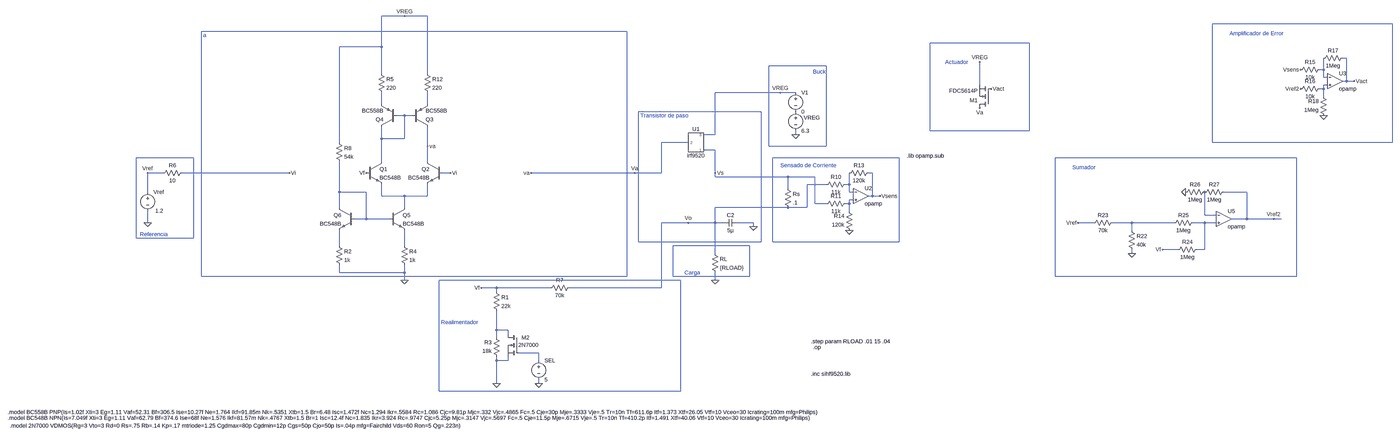
[diagram p0: schematic LDO.asc, whole sheet]
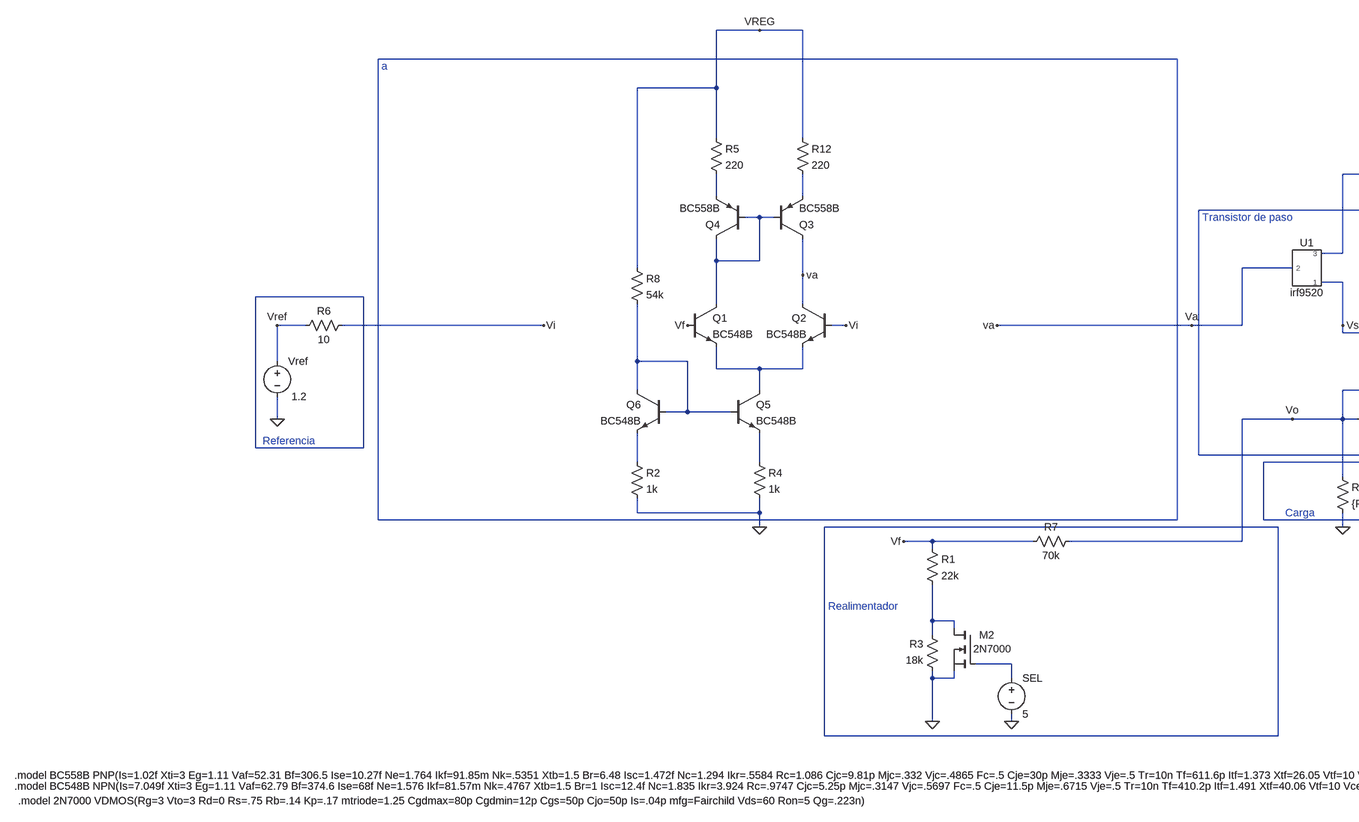
[diagram p1: schematic LDO.asc, part, row 1 of 1, column 1 of 2]
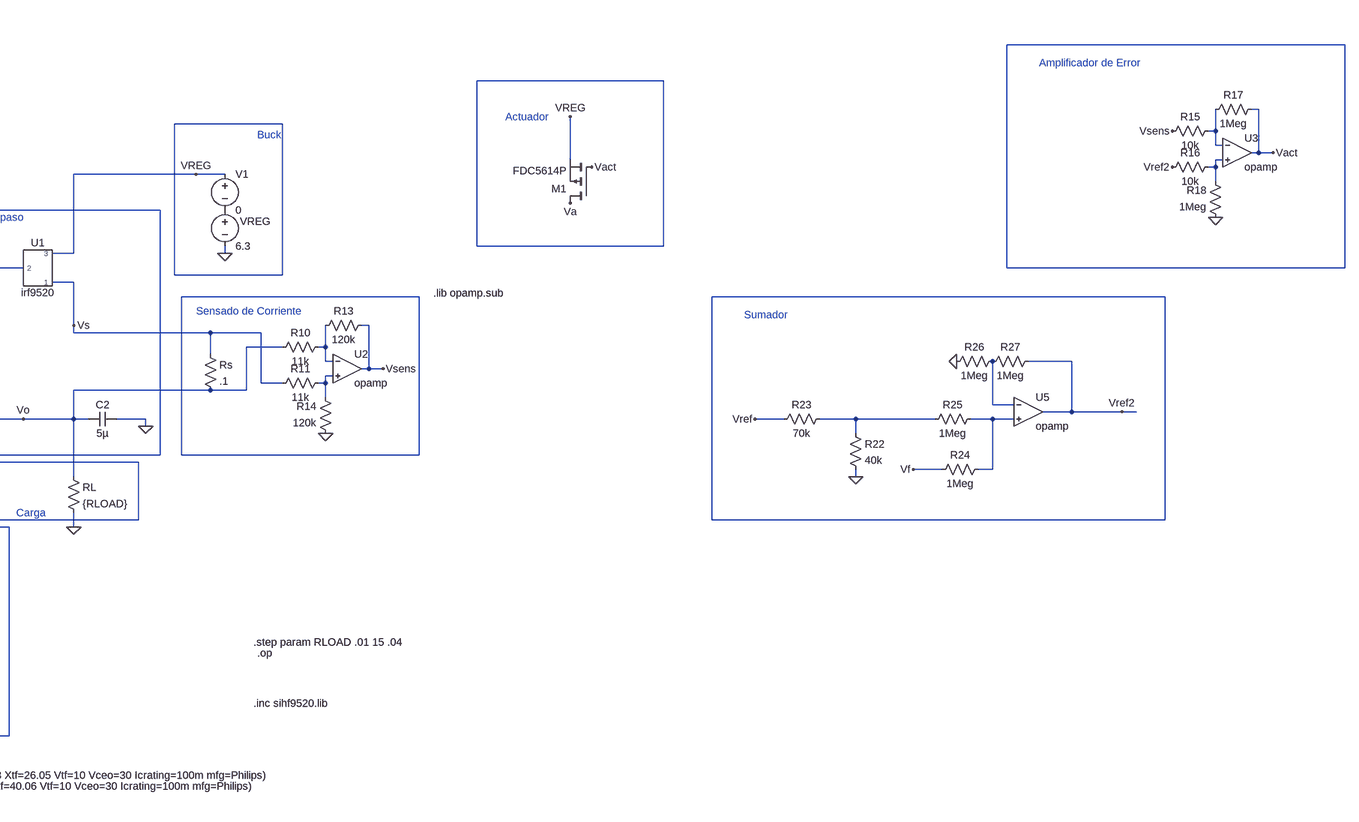
[diagram p2: schematic LDO.asc, part, row 1 of 1, column 2 of 2]
LDO.asc, the LTspice schematic file:
Version 4
SHEET 1 26844 1184
WIRE 336 -544 240 -544
WIRE 432 -544 336 -544
WIRE 4848 -512 3840 -512
WIRE 1264 -480 -512 -480
WIRE 2992 -432 2528 -432
WIRE 240 -416 240 -544
WIRE 240 -416 64 -416
WIRE 4400 -368 4384 -368
WIRE 2096 -336 1856 -336
WIRE 4304 -320 4304 -368
WIRE 4304 -320 4288 -320
WIRE 240 -304 240 -416
WIRE 432 -304 432 -544
WIRE 4304 -288 4304 -320
WIRE 4320 -288 4304 -288
WIRE 4400 -272 4400 -368
WIRE 4400 -272 4384 -272
WIRE 4432 -272 4400 -272
WIRE 2736 -256 2736 -352
WIRE 4320 -256 4304 -256
WIRE 4304 -240 4304 -256
WIRE 4304 -240 4288 -240
WIRE 1904 -224 1632 -224
WIRE 1968 -224 1904 -224
WIRE 4304 -208 4304 -240
WIRE 240 -176 240 -224
WIRE 432 -176 432 -224
WIRE 1824 -144 1312 -144
WIRE 336 -128 304 -128
WIRE 368 -128 336 -128
WIRE 2528 -64 2528 -432
WIRE 2992 -64 2992 -432
WIRE 2992 -64 2528 -64
WIRE 1632 -48 1632 -224
WIRE 1632 -48 1584 -48
WIRE 1968 -48 1968 -64
WIRE 240 -32 240 -80
WIRE 336 -32 336 -128
WIRE 336 -32 240 -32
WIRE 64 -16 64 -416
WIRE 1520 -16 1408 -16
WIRE 3840 -16 3840 -512
WIRE 4848 -16 4848 -512
WIRE 4848 -16 3840 -16
WIRE 432 0 432 -80
WIRE 1856 0 1856 -336
WIRE 2096 0 2096 -336
WIRE 2096 0 1856 0
WIRE 1632 16 1584 16
WIRE -544 48 -784 48
WIRE 2400 48 1872 48
WIRE 4192 48 3184 48
WIRE 240 64 240 -32
WIRE 432 64 432 0
WIRE -672 112 -736 112
WIRE -144 112 -592 112
WIRE 528 112 496 112
WIRE 1296 112 864 112
WIRE 1408 112 1408 -16
WIRE 1408 112 1296 112
WIRE 1632 112 1632 16
WIRE 2288 112 2272 112
WIRE 1632 128 1632 112
WIRE 1936 128 1632 128
WIRE 2048 128 1936 128
WIRE 2096 160 2016 160
WIRE 2192 160 2192 112
WIRE 2192 160 2176 160
WIRE 1936 176 1936 128
WIRE -736 192 -736 112
WIRE 64 192 64 64
WIRE 176 192 64 192
WIRE 2192 192 2192 160
WIRE 2208 192 2192 192
WIRE 3984 192 3888 192
WIRE 240 208 240 160
WIRE 336 208 240 208
WIRE 432 208 432 160
WIRE 432 208 336 208
WIRE 2288 208 2288 112
WIRE 2288 208 2272 208
WIRE 2320 208 2288 208
WIRE 2208 224 2192 224
WIRE 2048 240 2048 128
WIRE 2096 240 2048 240
WIRE 2192 240 2192 224
WIRE 2192 240 2176 240
WIRE 64 256 64 192
WIRE 336 256 336 208
WIRE 1936 256 1632 256
WIRE 2016 256 2016 160
WIRE 2016 256 1936 256
WIRE 2192 272 2192 240
WIRE 3808 288 3808 192
WIRE 3856 288 3808 288
WIRE 176 304 176 192
WIRE 176 304 128 304
WIRE 272 304 176 304
WIRE 3984 304 3984 192
WIRE 3984 304 3920 304
WIRE 4096 304 3984 304
WIRE 4128 304 4096 304
WIRE -736 320 -736 272
WIRE 1520 320 1408 320
WIRE 1632 320 1632 256
WIRE 1632 320 1520 320
WIRE 1664 320 1632 320
WIRE 1792 320 1728 320
WIRE 3344 320 3280 320
WIRE 3504 320 3424 320
WIRE 3680 320 3504 320
WIRE 3808 320 3760 320
WIRE 3856 320 3808 320
WIRE 1792 336 1792 320
WIRE 3504 352 3504 320
WIRE -784 384 -784 48
WIRE -544 384 -544 48
WIRE -544 384 -784 384
WIRE 1312 400 1312 -144
WIRE 1824 400 1824 -144
WIRE 1824 400 1312 400
WIRE 1872 400 1872 48
WIRE 2400 400 2400 48
WIRE 2400 400 1872 400
WIRE 64 416 64 352
WIRE 336 416 336 352
WIRE 1776 416 1456 416
WIRE 3696 432 3632 432
WIRE 3808 432 3808 320
WIRE 3808 432 3776 432
WIRE 1632 448 1632 320
WIRE 3504 448 3504 432
WIRE 64 528 64 496
WIRE 336 528 336 496
WIRE 336 528 64 528
WIRE -512 544 -512 -480
WIRE 1264 544 1264 -480
WIRE 1264 544 -512 544
WIRE 1456 544 1456 416
WIRE 1776 544 1776 416
WIRE 1776 544 1456 544
WIRE 3184 544 3184 48
WIRE 4192 544 4192 48
WIRE 4192 544 3184 544
WIRE 336 560 336 528
WIRE 1488 560 480 560
WIRE 1632 560 1632 528
WIRE 720 592 656 592
WIRE 944 592 720 592
WIRE 1408 592 1408 320
WIRE 1408 592 1024 592
WIRE 720 608 720 592
WIRE 720 768 720 688
WIRE 768 768 720 768
WIRE 768 784 768 768
WIRE 720 800 720 768
WIRE 896 864 816 864
WIRE 720 896 720 880
WIRE 768 896 768 880
WIRE 768 896 720 896
WIRE 896 896 896 864
WIRE 720 992 720 896
WIRE 896 992 896 976
WIRE 480 1024 480 560
WIRE 1488 1024 1488 560
WIRE 1488 1024 480 1024
FLAG 1632 560 0
FLAG -736 320 0
FLAG 1296 112 Va
FLAG -736 112 Vref
FLAG 720 992 0
FLAG 1520 320 Vo
FLAG 1968 -48 0
FLAG 1792 336 0
FLAG 336 560 0
FLAG 656 592 Vf
FLAG 336 -544 VREG
FLAG -144 112 Vi
FLAG 432 0 va
FLAG 864 112 va
FLAG 528 112 Vi
FLAG 176 112 Vf
FLAG 1904 -224 VREG
FLAG 896 992 0
FLAG 1632 112 Vs
FLAG 2736 -352 VREG
FLAG 2784 -240 Vact
FLAG 2736 -160 Va
FLAG 2320 208 Vsens
FLAG 2192 352 0
FLAG 3504 448 0
FLAG 4096 304 Vref2
FLAG 3280 320 Vref
FLAG 3632 432 Vf
FLAG 3728 192 0
FLAG 4304 -128 0
FLAG 4432 -272 Vact
FLAG 4208 -240 Vref2
FLAG 4208 -320 Vsens
SYMBOL voltage -736 176 R0
WINDOW 123 0 0 Left 0
WINDOW 39 0 0 Left 0
WINDOW 3 66 94 Right 2
SYMATTR Value 1.2
SYMATTR InstName Vref
SYMBOL res 1616 432 R0
SYMATTR InstName RL
SYMATTR Value {RLOAD}
SYMBOL res 704 592 R0
SYMATTR InstName R1
SYMATTR Value 22k
SYMBOL res 736 896 R180
WINDOW 0 36 76 Left 2
WINDOW 3 36 40 Left 2
SYMATTR InstName R3
SYMATTR Value 18k
SYMBOL voltage 1968 -160 R0
WINDOW 123 0 0 Left 0
WINDOW 39 0 0 Left 0
WINDOW 0 34 41 Left 2
SYMATTR InstName VREG
SYMATTR Value 6.3
SYMBOL voltage 1968 -240 R0
WINDOW 123 0 0 Left 0
WINDOW 39 0 0 Left 0
SYMATTR InstName V1
SYMATTR Value 0
SYMBOL cap 1728 304 R90
WINDOW 0 0 32 VBottom 2
WINDOW 3 32 32 VTop 2
SYMATTR InstName C2
SYMATTR Value 5µ
SYMBOL npn 176 64 R0
SYMATTR InstName Q1
SYMATTR Value BC548B
SYMBOL npn 496 64 M0
SYMATTR InstName Q2
SYMATTR Value BC548B
SYMBOL pnp 368 -80 M180
SYMATTR InstName Q3
SYMATTR Value BC558B
SYMBOL pnp 304 -80 R180
SYMATTR InstName Q4
SYMATTR Value BC558B
SYMBOL res 224 -320 R0
SYMATTR InstName R5
SYMATTR Value 220
SYMBOL res -576 96 R90
WINDOW 0 0 56 VBottom 2
WINDOW 3 32 56 VTop 2
SYMATTR InstName R6
SYMATTR Value 10
SYMBOL res 1040 576 R90
WINDOW 0 0 56 VBottom 2
WINDOW 3 32 56 VTop 2
SYMATTR InstName R7
SYMATTR Value 70k
SYMBOL voltage 896 880 R0
WINDOW 123 0 0 Left 0
WINDOW 39 0 0 Left 0
SYMATTR InstName SEL
SYMATTR Value 5
SYMBOL npn 272 256 R0
SYMATTR InstName Q5
SYMATTR Value BC548B
SYMBOL npn 128 256 M0
SYMATTR InstName Q6
SYMATTR Value BC548B
SYMBOL res 48 -32 R0
SYMATTR InstName R8
SYMATTR Value 54k
SYMBOL res 48 400 R0
SYMATTR InstName R2
SYMATTR Value 1k
SYMBOL res 320 400 R0
SYMATTR InstName R4
SYMATTR Value 1k
SYMBOL res 1920 160 R0
SYMATTR InstName Rs
SYMATTR Value .1
SYMBOL res 416 -320 R0
SYMATTR InstName R12
SYMATTR Value 220
SYMBOL nmos 816 784 M0
WINDOW 0 -42 16 Left 2
WINDOW 3 -80 47 Left 2
SYMATTR InstName M2
SYMATTR Value 2N7000
SYMBOL AutoGenerated\\irf9520 1552 -16 R0
SYMATTR InstName U1
SYMBOL pmos 2784 -160 R180
SYMATTR InstName M1
SYMATTR Value FDC5614P
SYMBOL OpAmps\\opamp 2240 144 R0
SYMATTR InstName U2
SYMBOL res 2192 144 R90
WINDOW 0 0 56 VBottom 2
WINDOW 3 32 56 VTop 2
SYMATTR InstName R10
SYMATTR Value 11k
SYMBOL res 2192 224 R90
WINDOW 0 0 56 VBottom 2
WINDOW 3 32 56 VTop 2
SYMATTR InstName R11
SYMATTR Value 11k
SYMBOL res 2288 96 R90
WINDOW 0 0 56 VBottom 2
WINDOW 3 32 56 VTop 2
SYMATTR InstName R13
SYMATTR Value 120k
SYMBOL res 2208 368 R180
WINDOW 0 36 76 Left 2
WINDOW 3 36 40 Left 2
SYMATTR InstName R14
SYMATTR Value 120k
SYMBOL res 3488 336 R0
SYMATTR InstName R22
SYMATTR Value 40k
SYMBOL res 3440 304 R90
WINDOW 0 0 56 VBottom 2
WINDOW 3 32 56 VTop 2
SYMATTR InstName R23
SYMATTR Value 70k
SYMBOL res 3792 416 R90
WINDOW 0 0 56 VBottom 2
WINDOW 3 32 56 VTop 2
SYMATTR InstName R24
SYMATTR Value 1Meg
SYMBOL res 3776 304 R90
WINDOW 0 0 56 VBottom 2
WINDOW 3 32 56 VTop 2
SYMATTR InstName R25
SYMATTR Value 1Meg
SYMBOL OpAmps\\opamp 3888 240 R0
SYMATTR InstName U5
SYMBOL res 3824 176 R90
WINDOW 0 0 56 VBottom 2
WINDOW 3 32 56 VTop 2
SYMATTR InstName R26
SYMATTR Value 1Meg
SYMBOL res 3904 176 R90
WINDOW 0 0 56 VBottom 2
WINDOW 3 32 56 VTop 2
SYMATTR InstName R27
SYMATTR Value 1Meg
SYMBOL OpAmps\\opamp 4352 -336 R0
SYMATTR InstName U3
SYMBOL res 4304 -336 R90
WINDOW 0 0 56 VBottom 2
WINDOW 3 32 56 VTop 2
SYMATTR InstName R15
SYMATTR Value 10k
SYMBOL res 4304 -256 R90
WINDOW 0 0 56 VBottom 2
WINDOW 3 32 56 VTop 2
SYMATTR InstName R16
SYMATTR Value 10k
SYMBOL res 4400 -384 R90
WINDOW 0 0 56 VBottom 2
WINDOW 3 32 56 VTop 2
SYMATTR InstName R17
SYMATTR Value 1Meg
SYMBOL res 4320 -112 R180
WINDOW 0 36 76 Left 2
WINDOW 3 36 40 Left 2
SYMATTR InstName R18
SYMATTR Value 1Meg
TEXT -768 368 Left 2 ;Referencia
TEXT 488 736 Left 2 ;Realimentador
TEXT -504 -464 Left 2 ;a
TEXT 1320 -128 Left 2 ;Transistor de paso
TEXT 1504 528 Left 2 ;Carga
TEXT 2032 816 Left 2 !.step param RLOAD .01 15 .04
TEXT -1320 1112 Left 2 !.model BC558B PNP(Is=1.02f Xti=3 Eg=1.11 Vaf=52.31 Bf=306.5 Ise=10.27f Ne=1.764 Ikf=91.85m Nk=.5351 Xtb=1.5 Br=6.48 Isc=1.472f Nc=1.294 Ikr=.5584 Rc=1.086 Cjc=9.81p Mjc=.332 Vjc=.4865 Fc=.5 Cje=30p Mje=.3333 Vje=.5 Tr=10n Tf=611.6p Itf=1.373 Xtf=26.05 Vtf=10 Vceo=30 Icrating=100m mfg=Philips)
TEXT -1320 1136 Left 2 !.model BC548B NPN(Is=7.049f Xti=3 Eg=1.11 Vaf=62.79 Bf=374.6 Ise=68f Ne=1.576 Ikf=81.57m Nk=.4767 Xtb=1.5 Br=1 Isc=12.4f Nc=1.835 Ikr=3.924 Rc=.9747 Cjc=5.25p Mjc=.3147 Vjc=.5697 Fc=.5 Cje=11.5p Mje=.6715 Vje=.5 Tr=10n Tf=410.2p Itf=1.491 Xtf=40.06 Vtf=10 Vceo=30 Icrating=100m mfg=Philips)
TEXT 2040 840 Left 2 !.op
TEXT 2040 -312 Left 2 ;Buck
TEXT 2032 952 Left 2 !.inc sihf9520.lib
TEXT -1312 1168 Left 2 !.model 2N7000 VDMOS(Rg=3 Vto=3 Rd=0 Rs=.75 Rb=.14 Kp=.17 mtriode=1.25 Cgdmax=80p Cgdmin=12p Cgs=50p Cjo=50p Is=.04p mfg=Fairchild Vds=60 Ron=5 Qg=.223n)
TEXT 2592 -352 Left 2 ;Actuador
TEXT 2432 40 Left 2 !.lib opamp.sub
TEXT 3256 88 Left 2 ;Sumador
TEXT 3912 -472 Left 2 ;Amplificador de Error
TEXT 1904 80 Left 2 ;Sensado de Corriente

The netlist it stands for:
* LDO.asc
Vref Vref 0 1.2
RL Vo 0 {RLOAD}
R1 Vf N025 22k
R3 0 N025 18k
VREG P001 0 6.3
V1 VREG P001 0
C2 0 Vo 5µ
Q1 N010 Vf N016 0 BC548B
Q2 Va Vi N016 0 BC548B
Q3 Va N010 N008 0 BC558B
Q4 N010 N010 N007 0 BC558B
R5 VREG N007 220
R6 Vi Vref 10
R7 Vo Vf 70k
V§SEL N026 0 5
Q5 N016 N015 N022 0 BC548B
Q6 N015 N015 N021 0 BC548B
R8 VREG N015 54k
R2 N021 0 1k
R4 N022 0 1k
Rs Vs Vo .1
R12 VREG N008 220
M2 N025 N026 0 0 2N7000
XU1 Vs Va VREG irf9520  ; pins 1 2 3
M1 Va Vact VREG VREG FDC5614P
XU2 N014 N017 Vsens opamp Aol=100K GBW=10Meg  ; pins invin noninvin out
R10 N014 Vo 11k
R11 N017 Vs 11k
R13 Vsens N014 120k
R14 0 N017 120k
R22 N019 0 40k
R23 N019 Vref 70k
R24 N020 Vf 1Meg
R25 N020 N019 1Meg
XU5 N018 N020 Vref2 opamp Aol=100K GBW=10Meg  ; pins invin noninvin out
R26 N018 0 1Meg
R27 Vref2 N018 1Meg
XU3 N005 N006 Vact opamp Aol=100K GBW=10Meg  ; pins invin noninvin out
R15 N005 Vsens 10k
R16 N006 Vref2 10k
R17 Vact N005 1Meg
R18 0 N006 1Meg
.model NPN NPN
.model PNP PNP
.lib standard.bjt
.model NMOS NMOS
.model PMOS PMOS
.lib standard.mos
* Referencia
* Realimentador
* a
* Transistor de paso
* Carga
.step param RLOAD .01 15 .04
.model BC558B PNP(Is=1.02f Xti=3 Eg=1.11 Vaf=52.31 Bf=306.5 Ise=10.27f Ne=1.764 Ikf=91.85m Nk=.5351 Xtb=1.5 Br=6.48 Isc=1.472f Nc=1.294 Ikr=.5584 Rc=1.086 Cjc=9.81p Mjc=.332 Vjc=.4865 Fc=.5 Cje=30p Mje=.3333 Vje=.5 Tr=10n Tf=611.6p Itf=1.373 Xtf=26.05 Vtf=10 Vceo=30 Icrating=100m mfg=Philips)
.model BC548B NPN(Is=7.049f Xti=3 Eg=1.11 Vaf=62.79 Bf=374.6 Ise=68f Ne=1.576 Ikf=81.57m Nk=.4767 Xtb=1.5 Br=1 Isc=12.4f Nc=1.835 Ikr=3.924 Rc=.9747 Cjc=5.25p Mjc=.3147 Vjc=.5697 Fc=.5 Cje=11.5p Mje=.6715 Vje=.5 Tr=10n Tf=410.2p Itf=1.491 Xtf=40.06 Vtf=10 Vceo=30 Icrating=100m mfg=Philips)
.op
* Buck
.inc sihf9520.lib
.model 2N7000 VDMOS(Rg=3 Vto=3 Rd=0 Rs=.75 Rb=.14 Kp=.17 mtriode=1.25 Cgdmax=80p Cgdmin=12p Cgs=50p Cjo=50p Is=.04p mfg=Fairchild Vds=60 Ron=5 Qg=.223n)
* Actuador
.lib opamp.sub
* Sumador
* Amplificador de Error
* Sensado de Corriente
.lib sihf9520.txt
.backanno
.end

* Results of the author's LTspice run, read from the files saved beside the schematic
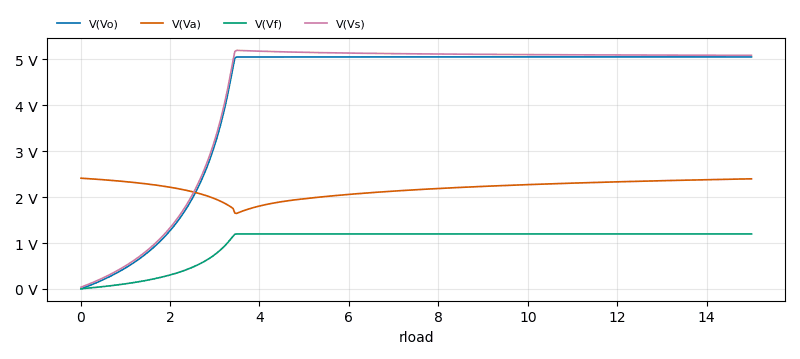
[diagram p3: Operating Point of LDO.asc, plotted from the saved traces]
* Operating Point, 1 run:
*   V(Vo): 3.555 mV at rload=10 m, 5.052 V at rload=15 , min 3.555 mV, max 5.052 V
*   V(Va): 2.411 V at rload=10 m, 2.398 V at rload=15 , min 1.645 V, max 2.411 V
*   V(Vf): 4.421 mV at rload=10 m, 1.198 V at rload=15 , min 4.421 mV, max 1.198 V
*   V(Vs): 39.11 mV at rload=10 m, 5.085 V at rload=15 , min 39.11 mV, max 5.194 V
* From the log:
*   Semiconductor Device Operating Points:
*                           --- Diodes ---
*   Name:    d:u1:4      d:u1:3      d:u1:2      d:u1:1
*   Model:   u1:md3      u1:md2      u1:md1       u1:md
*   Id:     -1.02e-10   -1.48e-10   -2.30e-12   -6.26e-12
*   Vd:     -2.30e+00   -2.30e+00   -2.30e+00   -6.26e+00
*   Req:     1.00e+12    1.00e+12    1.00e+12    1.00e+12
*   CAP:     0.00e+00    0.00e+00    1.79e-10    2.30e-10
*                           --- Bipolar Transistors ---
*   Name:       q4          q3          q6          q5          q2
*   Model:    bc558b      bc558b      bc548b      bc548b      bc548b
*   Ib:      -1.72e-12    1.95e-12    4.65e-07    4.66e-07    4.56e-07
*   Ic:      -6.35e-12   -1.05e-11    1.03e-04    1.03e-04    1.02e-04
*   Vbe:     -2.27e-01   -2.27e-01    6.05e-01    6.05e-01    6.05e-01
*   Vbc:      0.00e+00    3.66e+00    0.00e+00    1.13e-01   -1.21e+00
*   Vce:     -2.27e-01   -3.89e+00    6.05e-01    4.92e-01    1.82e+00
*   BetaDC:   3.70e+00   -5.37e+00    2.20e+02    2.20e+02    2.24e+02
*   Gm:       2.52e-10    2.70e-10    3.96e-03    3.96e-03    3.94e-03
*   Rpi:      2.92e+10    2.92e+10    6.54e+04    6.53e+04    6.68e+04
*   Rx:       0.00e+00    0.00e+00    0.00e+00    0.00e+00    0.00e+00
*   Ro:       6.09e+12    8.01e+12    6.12e+05    6.11e+05    6.27e+05
*   Cbe:      3.67e-11    3.67e-11    3.74e-11    3.74e-11    3.74e-11
*   Cbc:      9.81e-12    4.82e-12    5.25e-12    5.63e-12    3.67e-12
*   Cjs:      0.00e+00    0.00e+00    0.00e+00    0.00e+00    0.00e+00
*   BetaAC:   7.38e+00    7.90e+00    2.59e+02    2.59e+02    2.63e+02
*   Cbx:      0.00e+00    0.00e+00    0.00e+00    0.00e+00    0.00e+00
*   Ft:       8.56e-01    1.03e+00    1.48e+07    1.46e+07    1.53e+07
*   Name:       q1
*   Model:    bc548b
*   Ib:      -6.75e-12
*   Ic:       6.09e-12
*   Vbe:     -5.91e-01
*   Vbc:     -6.07e+00
*   Vce:      5.48e+00
*   BetaDC:  -9.02e-01
*   Gm:       3.58e-23
*   Rpi:      1.00e+12
*   Rx:       0.00e+00
*   Ro:       7.43e+25
*   Cbe:      6.81e-12
*   Cbc:      2.42e-12
*   Cjs:      0.00e+00
*   BetaAC:   3.58e-11
*   Cbx:      0.00e+00
*   Ft:       1.72e-02
*                           --- VDMOSFET Transistors ---
*   Name:          m1          m2
*   Model:      fdc5614p     2n7000
*   Id:         -1.02e-04    2.01e-07
*   Vgs:        -1.55e+00    5.00e+00
*   Vds:        -3.89e+00    6.23e-07
*   Vth:        -1.85e+00    3.00e+00
*   Gm:          1.99e-03    1.00e-07
*   Gds:         1.90e-06    4.25e-01
*   Cgs:         9.60e-10    5.00e-11
*   Cgd:         9.56e-11    8.00e-11
*   Cbody:       4.34e-10    5.00e-11
*                           --- MOSFET Transistors ---
*   Name:        m:u1:1
*   Model:        u1:mm
*   Id:         -3.56e-01
*   Vgs:        -3.83e+00
*   Vds:        -6.13e+00
*   Vbs:         0.00e+00
*   Vth:        -3.41e+00
*   Vdsat:      -4.17e-01
*   Gm:          1.70e+00
*   Gds:         8.73e-03
*   Gmb:         0.00e+00
*   Cbd:         0.00e+00
*   Cbs:         0.00e+00
*   Cgsov:       3.45e-10
*   Cgdov:       1.00e-15
*   Cgbov:       0.00e+00
*   Cgs:         0.00e+00
*   Cgd:         0.00e+00
*   Cgb:         0.00e+00